# EAGLE schematic proiectPM (EAGLE 9.7.0)
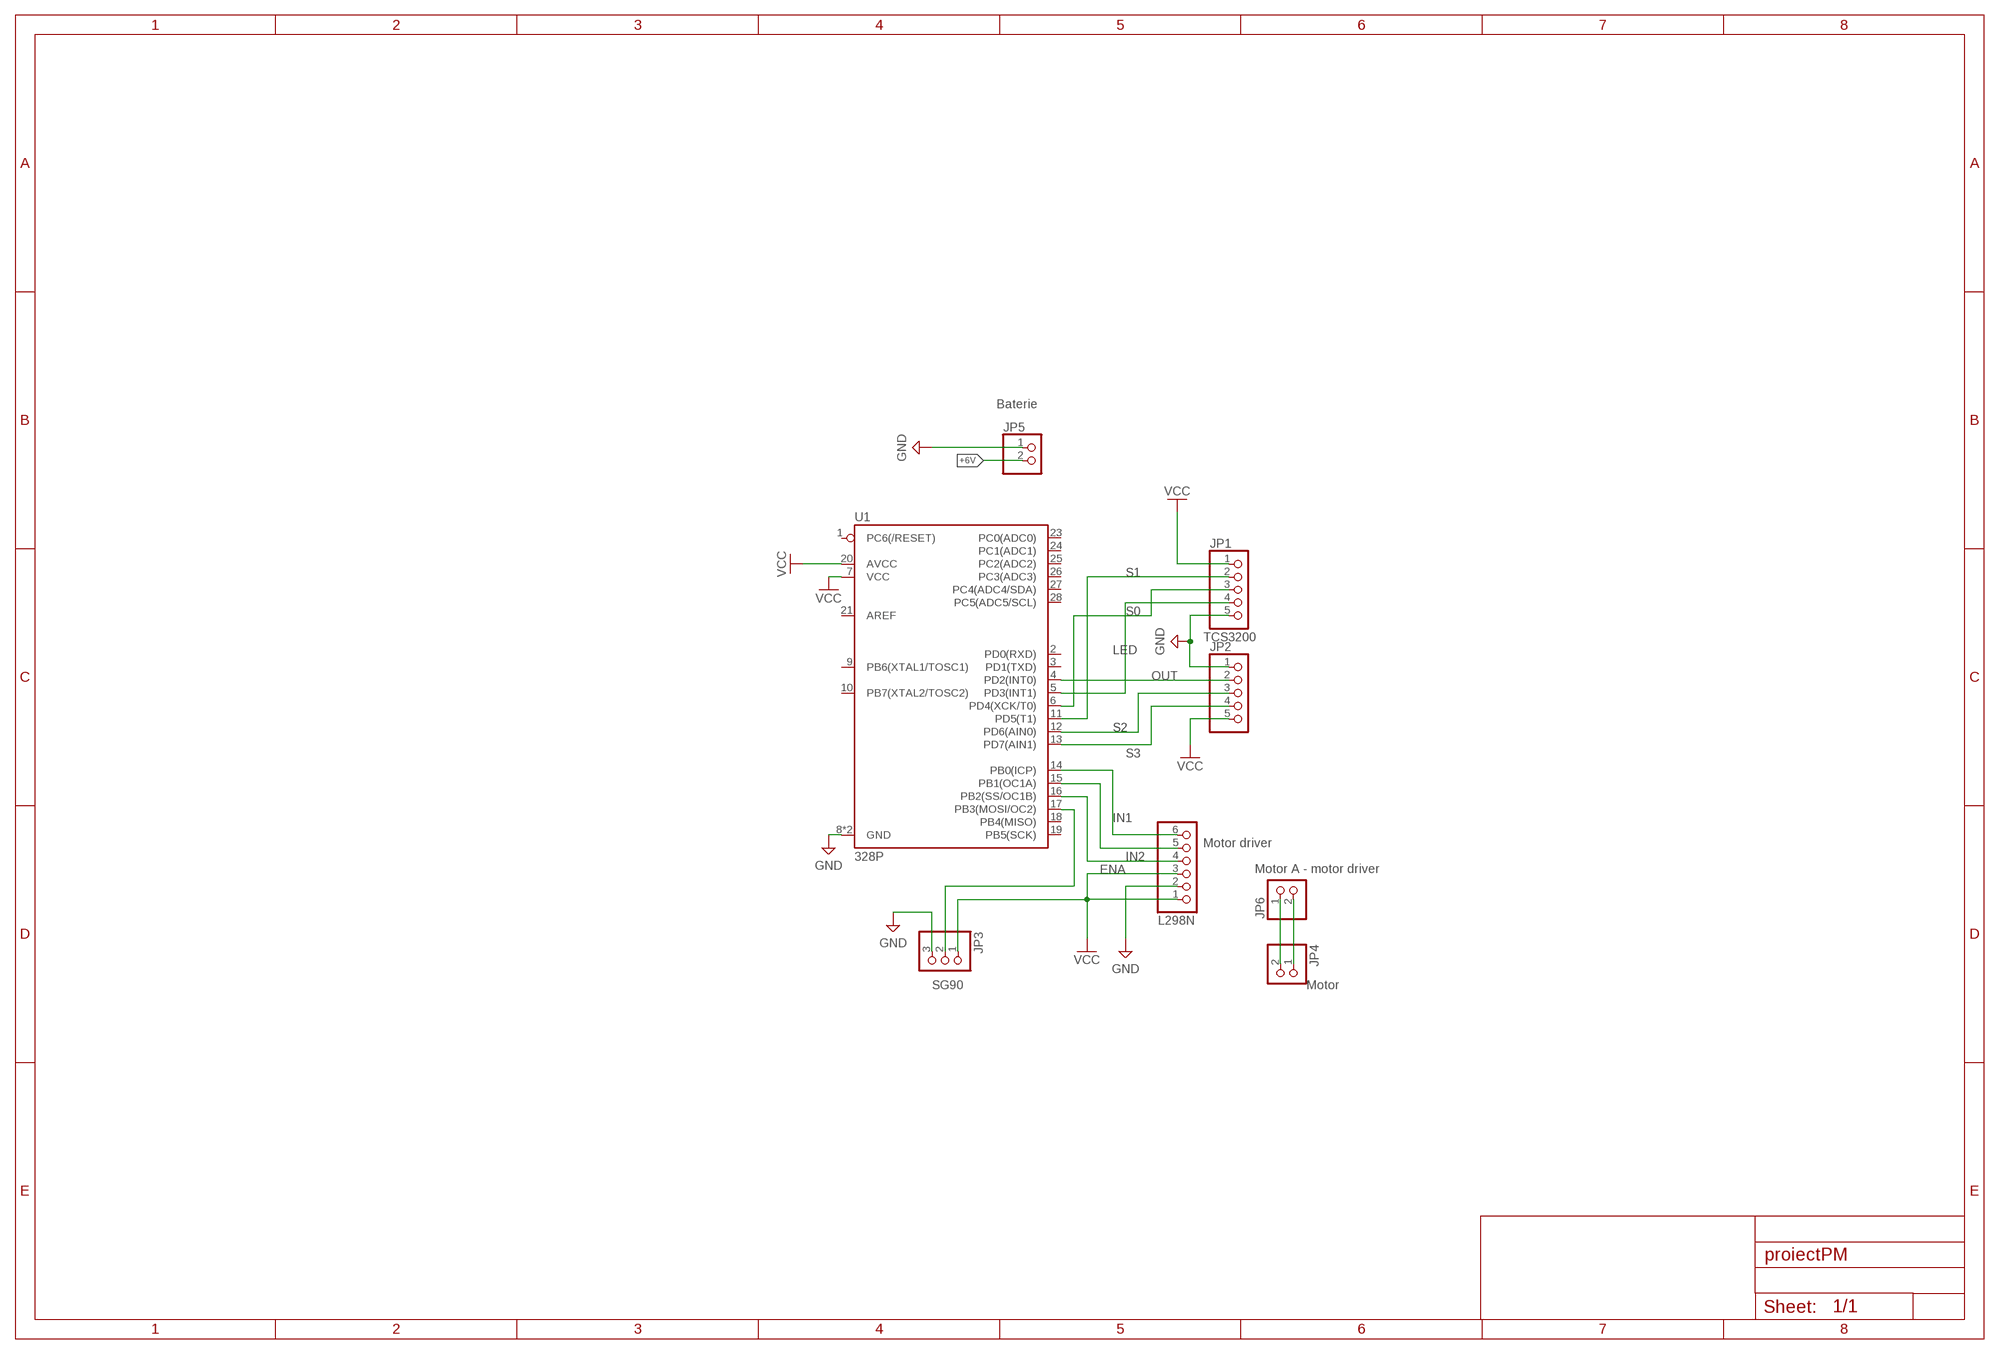
[diagram p0: schematic, sheet 1]

## Parts
JP1  PINHD-1X5  [1X05]
JP2  PINHD-1X5  [1X05]
JP3  PINHD-1X3  [1X03]
JP4  PINHD-1X2  [1X02]
JP5  PINHD-1X2  [1X02]
JP6  PINHD-1X2  [1X02]
L298N  PINHD-1X6  [1X06]
U1  328P  ATMEGA328P_PDIP  [DIP28]

## Nets
+6V: JP5.2
ENA: L298N.4 U1.16(PB2(SS/OC1B))
GND: JP1.5 JP2.1 JP3.3 JP5.1 L298N.2 U1.8(GND) U1.22(GND)
IN1: L298N.6 U1.14(PB0(ICP))
IN2: L298N.5 U1.15(PB1(OC1A))
LED: JP1.4 U1.5(PD3(INT1))
N$1: JP3.2 U1.17(PB3(MOSI/OC2))
N$2: JP4.2 JP6.1
N$3: JP4.1 JP6.2
OUT: JP2.2 U1.4(PD2(INT0))
S0: JP1.3 U1.6(PD4(XCK/T0))
S1: JP1.2 U1.11(PD5(T1))
S2: JP2.3 U1.12(PD6(AIN0))
S3: JP2.4 U1.13(PD7(AIN1))
VCC: JP1.1 JP2.5 JP3.1 L298N.1 L298N.3 U1.7(VCC) U1.20(AVCC)
Unconnected: U1.1(PC6(/RESET)) U1.2(PD0(RXD)) U1.3(PD1(TXD)) U1.9(PB6(XTAL1/TOSC1)) U1.10(PB7(XTAL2/TOSC2)) U1.18(PB4(MISO)) U1.19(PB5(SCK)) U1.21(AREF) U1.23(PC0(ADC0)) U1.24(PC1(ADC1)) U1.25(PC2(ADC2)) U1.26(PC3(ADC3)) U1.27(PC4(ADC4/SDA)) U1.28(PC5(ADC5/SCL))

## Notes on the sheet
- Baterie
- TCS3200
- Motor driver
- Motor A - motor driver
- SG90 | Motor

## Library data of the parts
JP1 JP2 = pinhead:PINHD-1X5: PIN HEADER
JP3 = pinhead:PINHD-1X3: PIN HEADER
JP4-JP6 = pinhead:PINHD-1X2: PIN HEADER
L298N = pinhead:PINHD-1X6: PIN HEADER
U1 = SparkFun-IC-Microcontroller:ATMEGA328P_PDIP: Atmel 328P Through hole ATMEGA328P uC used in the Arduino 32kb flash, 1k EEPROM, 2k SRAM Datasheet <http://www.sparkfun.com/datasheets/Components/SMD/ATMega328.pdf> SparkFun Products Storefront component: AVR 28 Pin 20MHz 32K 6A/D - ATMega328P <https://www.sparkfun.com/products/9061> (COM-09061) SparkFun Simon Says - Through-Hole Soldering Kit <https://www.sparkfun.com/products/10547> (KIT-10547) SparkFun Learn to Solder - Simon Says <https://www.sparkfun.com/products/13708> (KIT-13708) SparkFun BigTime Watch Kit <https://www.sparkfun.com/products/11734> (KIT-11734) SparkFun ClockIt <https://www.sparkfun.com/products/10930> (KIT-10930) SparkFun Serial Enabled LCD Kit <https://www.sparkfun.com/products/10097> (LCD-10097) SparkFun Simon Tilts - Through Hole Soldering Kit <https://www.sparkfun.com/products/12634> (KIT-12634) SparkFun Frequency Counter Kit <https://www.sparkfun.com/products/10140> (KIT-10140) FabFM Radio Kit <https://www.sparkfun.com/products/11043> (KIT-11043) SparkFun Binary Blaster Kit <https://www.sparkfun.com/products/12037> (KIT-12037) SparkFun Metro-Gnome <https://www.sparkfun.com/products/9236> (KIT-09236) ATmega328 with Arduino Optiboot (Uno) <https://www.sparkfun.com/products/10524> (DEV-10524); PROD_ID: IC-09136